# EAGLE schematic Schaltplan (EAGLE 9.7.0)

## Sheet 1 of 6: SCD30
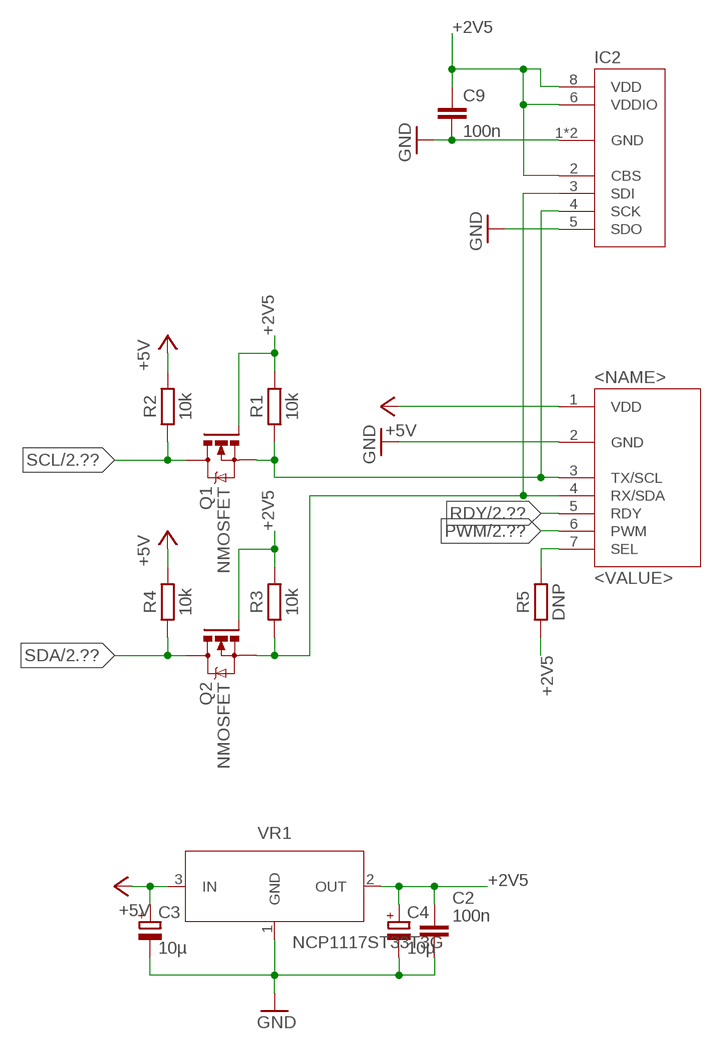
[diagram p0: schematic, sheet 1]

### Parts
C2  100n  C_CHIP-0603(1608-METRIC)  [CAPC1608X85]
C3  10µ  CPOL-EU153CLV-0505  [153CLV-0505]
C4  10µ  CPOL-EU153CLV-0505  [153CLV-0505]
C9  100n  C-EUC0603  [C0603]
IC2  BMP280  [SON65P200X250X95-8N]
Q1  NMOSFET  NMOSFETSOT23  [SOT23]
Q2  NMOSFET  NMOSFETSOT23  [SOT23]
R1  10k  R_CHIP-0603(1608-METRIC)  [RESC1608X60]
R2  10k  R_CHIP-0603(1608-METRIC)  [RESC1608X60]
R3  10k  R_CHIP-0603(1608-METRIC)  [RESC1608X60]
R4  10k  R_CHIP-0603(1608-METRIC)  [RESC1608X60]
R5  DNP  R_CHIP-0603(1608-METRIC)  [RESC1608X60]
U$1  SDC30  [HDRV7W80P254_1X7_1778X254X838B]
VR1  NCP1117ST33T3G  NCP1117ST33T3GSOT-223  [SOT230P700X170-4]

### Nets
+2V5: C2.1 C4.+ C9.1 IC2.2(CBS) IC2.6(VDDIO) IC2.8(VDD) Q1.1(G) Q2.1(G) R1.2 R3.2 R5.1 VR1.2(OUT)
+5V [high_power]: C3.+ R2.2 R4.2 U$1.1(VDD) VR1.3(IN) ; also sheet 2,3,4,5,6
GND: C2.2 C3.- C4.- C9.2 IC2.1(GND) IC2.5(SDO) IC2.7(GND) U$1.2(GND) VR1.1(GND) ; also sheet 2,3,4,5,6
N$1: IC2.4(SCK) Q1.2(S) R1.1 U$1.3(TX/SCL)
N$3: R5.2 U$1.7(SEL)
N$6: IC2.3(SDI) Q2.2(S) R3.1 U$1.4(RX/SDA)
PWM: U$1.6(PWM) ; also sheet 2,6
RDY: U$1.5(RDY) ; also sheet 2,6
SCL: Q1.3(D) R2.1 ; also sheet 2,6
SDA: Q2.3(D) R4.1 ; also sheet 2,6

## Sheet 2 of 6
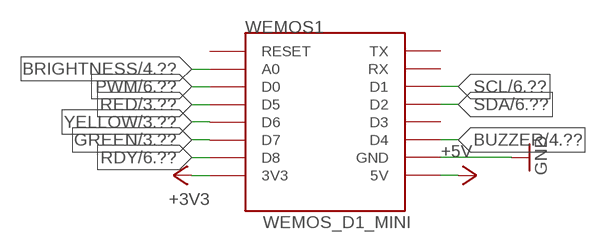
[diagram p1: schematic, sheet 2]

### Parts
WEMOS1  WEMOS_D1_MINI  [HDRVR8W64P254_1X8_2032X254X850B]

### Nets
+3V3: WEMOS1.3V3
+5V [high_power]: WEMOS1.5V ; also sheet 1,3,4,5,6
BRIGHTNESS: WEMOS1.A0 ; also sheet 4,6
BUZZER: WEMOS1.D4 ; also sheet 4,6
GND: WEMOS1.GND ; also sheet 1,3,4,5,6
GREEN: WEMOS1.D7 ; also sheet 3,6
PWM: WEMOS1.D0 ; also sheet 1,6
RDY: WEMOS1.D8 ; also sheet 1,6
RED: WEMOS1.D5 ; also sheet 3,6
SCL: WEMOS1.D1 ; also sheet 1,6
SDA: WEMOS1.D2 ; also sheet 1,6
YELLOW: WEMOS1.D6 ; also sheet 3,6
Unconnected: WEMOS1.D3 WEMOS1.RESET WEMOS1.RX WEMOS1.TX

## Sheet 3 of 6
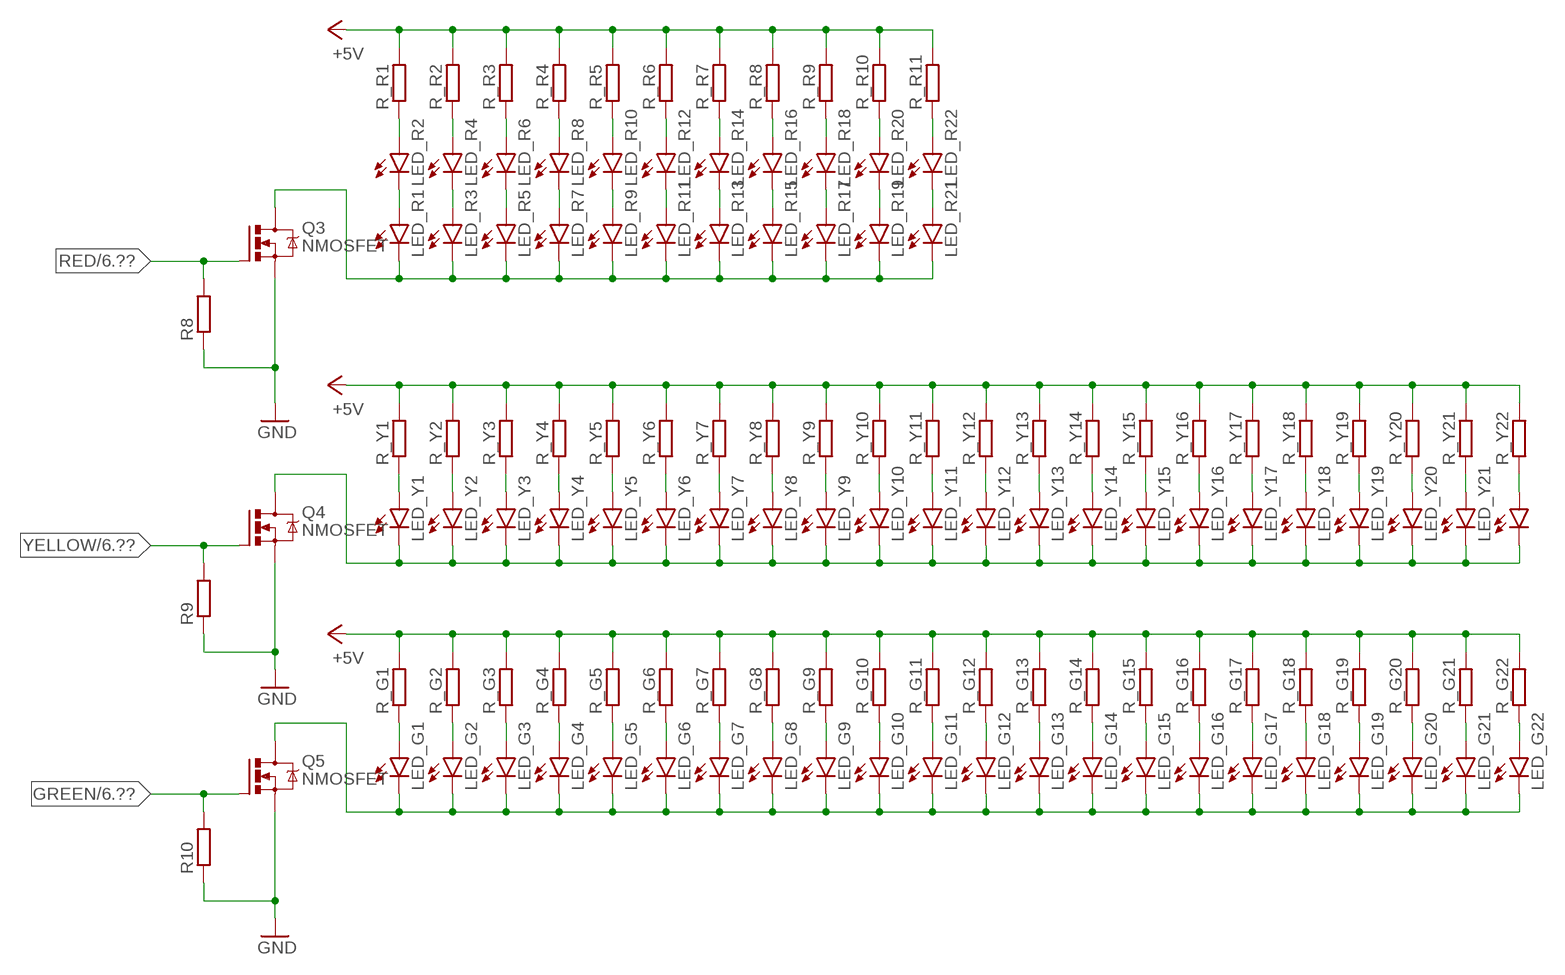
[diagram p2: schematic, sheet 3]

### Parts
LED_G1  LEDCHIP-LED0805  [CHIP-LED0805]
LED_G2  LEDCHIP-LED0805  [CHIP-LED0805]
LED_G3  LEDCHIP-LED0805  [CHIP-LED0805]
LED_G4  LEDCHIP-LED0805  [CHIP-LED0805]
LED_G5  LEDCHIP-LED0805  [CHIP-LED0805]
LED_G6  LEDCHIP-LED0805  [CHIP-LED0805]
LED_G7  LEDCHIP-LED0805  [CHIP-LED0805]
LED_G8  LEDCHIP-LED0805  [CHIP-LED0805]
LED_G9  LEDCHIP-LED0805  [CHIP-LED0805]
LED_G10  LEDCHIP-LED0805  [CHIP-LED0805]
LED_G11  LEDCHIP-LED0805  [CHIP-LED0805]
LED_G12  LEDCHIP-LED0805  [CHIP-LED0805]
LED_G13  LEDCHIP-LED0805  [CHIP-LED0805]
LED_G14  LEDCHIP-LED0805  [CHIP-LED0805]
LED_G15  LEDCHIP-LED0805  [CHIP-LED0805]
LED_G16  LEDCHIP-LED0805  [CHIP-LED0805]
LED_G17  LEDCHIP-LED0805  [CHIP-LED0805]
LED_G18  LEDCHIP-LED0805  [CHIP-LED0805]
LED_G19  LEDCHIP-LED0805  [CHIP-LED0805]
LED_G20  LEDCHIP-LED0805  [CHIP-LED0805]
LED_G21  LEDCHIP-LED0805  [CHIP-LED0805]
LED_G22  LEDCHIP-LED0805  [CHIP-LED0805]
LED_R1  LEDCHIP-LED0805  [CHIP-LED0805]
LED_R2  LEDCHIP-LED0805  [CHIP-LED0805]
LED_R3  LEDCHIP-LED0805  [CHIP-LED0805]
LED_R4  LEDCHIP-LED0805  [CHIP-LED0805]
LED_R5  LEDCHIP-LED0805  [CHIP-LED0805]
LED_R6  LEDCHIP-LED0805  [CHIP-LED0805]
LED_R7  LEDCHIP-LED0805  [CHIP-LED0805]
LED_R8  LEDCHIP-LED0805  [CHIP-LED0805]
LED_R9  LEDCHIP-LED0805  [CHIP-LED0805]
LED_R10  LEDCHIP-LED0805  [CHIP-LED0805]
LED_R11  LEDCHIP-LED0805  [CHIP-LED0805]
LED_R12  LEDCHIP-LED0805  [CHIP-LED0805]
LED_R13  LEDCHIP-LED0805  [CHIP-LED0805]
LED_R14  LEDCHIP-LED0805  [CHIP-LED0805]
LED_R15  LEDCHIP-LED0805  [CHIP-LED0805]
LED_R16  LEDCHIP-LED0805  [CHIP-LED0805]
LED_R17  LEDCHIP-LED0805  [CHIP-LED0805]
LED_R18  LEDCHIP-LED0805  [CHIP-LED0805]
LED_R19  LEDCHIP-LED0805  [CHIP-LED0805]
LED_R20  LEDCHIP-LED0805  [CHIP-LED0805]
LED_R21  LEDCHIP-LED0805  [CHIP-LED0805]
LED_R22  LEDCHIP-LED0805  [CHIP-LED0805]
LED_Y1  LEDCHIP-LED0805  [CHIP-LED0805]
LED_Y2  LEDCHIP-LED0805  [CHIP-LED0805]
LED_Y3  LEDCHIP-LED0805  [CHIP-LED0805]
LED_Y4  LEDCHIP-LED0805  [CHIP-LED0805]
LED_Y5  LEDCHIP-LED0805  [CHIP-LED0805]
LED_Y6  LEDCHIP-LED0805  [CHIP-LED0805]
LED_Y7  LEDCHIP-LED0805  [CHIP-LED0805]
LED_Y8  LEDCHIP-LED0805  [CHIP-LED0805]
LED_Y9  LEDCHIP-LED0805  [CHIP-LED0805]
LED_Y10  LEDCHIP-LED0805  [CHIP-LED0805]
LED_Y11  LEDCHIP-LED0805  [CHIP-LED0805]
LED_Y12  LEDCHIP-LED0805  [CHIP-LED0805]
LED_Y13  LEDCHIP-LED0805  [CHIP-LED0805]
LED_Y14  LEDCHIP-LED0805  [CHIP-LED0805]
LED_Y15  LEDCHIP-LED0805  [CHIP-LED0805]
LED_Y16  LEDCHIP-LED0805  [CHIP-LED0805]
LED_Y17  LEDCHIP-LED0805  [CHIP-LED0805]
LED_Y18  LEDCHIP-LED0805  [CHIP-LED0805]
LED_Y19  LEDCHIP-LED0805  [CHIP-LED0805]
LED_Y20  LEDCHIP-LED0805  [CHIP-LED0805]
LED_Y21  LEDCHIP-LED0805  [CHIP-LED0805]
LED_Y22  LEDCHIP-LED0805  [CHIP-LED0805]
Q3  NMOSFET  NMOSFETSOT23  [SOT23]
Q4  NMOSFET  NMOSFETSOT23  [SOT23]
Q5  NMOSFET  NMOSFETSOT23  [SOT23]
R8  R-EU_R0805  [R0805]
R9  R-EU_R0805  [R0805]
R10  R-EU_R0805  [R0805]
R_G1  R-EU_R0805  [R0805]
R_G2  R-EU_R0805  [R0805]
R_G3  R-EU_R0805  [R0805]
R_G4  R-EU_R0805  [R0805]
R_G5  R-EU_R0805  [R0805]
R_G6  R-EU_R0805  [R0805]
R_G7  R-EU_R0805  [R0805]
R_G8  R-EU_R0805  [R0805]
R_G9  R-EU_R0805  [R0805]
R_G10  R-EU_R0805  [R0805]
R_G11  R-EU_R0805  [R0805]
R_G12  R-EU_R0805  [R0805]
R_G13  R-EU_R0805  [R0805]
R_G14  R-EU_R0805  [R0805]
R_G15  R-EU_R0805  [R0805]
R_G16  R-EU_R0805  [R0805]
R_G17  R-EU_R0805  [R0805]
R_G18  R-EU_R0805  [R0805]
R_G19  R-EU_R0805  [R0805]
R_G20  R-EU_R0805  [R0805]
R_G21  R-EU_R0805  [R0805]
R_G22  R-EU_R0805  [R0805]
R_R1  R-EU_R0805  [R0805]
R_R2  R-EU_R0805  [R0805]
R_R3  R-EU_R0805  [R0805]
R_R4  R-EU_R0805  [R0805]
R_R5  R-EU_R0805  [R0805]
R_R6  R-EU_R0805  [R0805]
R_R7  R-EU_R0805  [R0805]
R_R8  R-EU_R0805  [R0805]
R_R9  R-EU_R0805  [R0805]
R_R10  R-EU_R0805  [R0805]
R_R11  R-EU_R0805  [R0805]
R_Y1  R-EU_R0805  [R0805]
R_Y2  R-EU_R0805  [R0805]
R_Y3  R-EU_R0805  [R0805]
R_Y4  R-EU_R0805  [R0805]
R_Y5  R-EU_R0805  [R0805]
R_Y6  R-EU_R0805  [R0805]
R_Y7  R-EU_R0805  [R0805]
R_Y8  R-EU_R0805  [R0805]
R_Y9  R-EU_R0805  [R0805]
R_Y10  R-EU_R0805  [R0805]
R_Y11  R-EU_R0805  [R0805]
R_Y12  R-EU_R0805  [R0805]
R_Y13  R-EU_R0805  [R0805]
R_Y14  R-EU_R0805  [R0805]
R_Y15  R-EU_R0805  [R0805]
R_Y16  R-EU_R0805  [R0805]
R_Y17  R-EU_R0805  [R0805]
R_Y18  R-EU_R0805  [R0805]
R_Y19  R-EU_R0805  [R0805]
R_Y20  R-EU_R0805  [R0805]
R_Y21  R-EU_R0805  [R0805]
R_Y22  R-EU_R0805  [R0805]

### Nets
+5V [high_power]: R_G1.2 R_G2.2 R_G3.2 R_G4.2 R_G5.2 R_G6.2 R_G7.2 R_G8.2 R_G9.2 R_G10.2 R_G11.2 R_G12.2 R_G13.2 R_G14.2 R_G15.2 R_G16.2 R_G17.2 R_G18.2 R_G19.2 R_G20.2 R_G21.2 R_G22.2 R_R1.2 R_R2.2 R_R3.2 R_R4.2 R_R5.2 R_R6.2 R_R7.2 R_R8.2 R_R9.2 R_R10.2 R_R11.2 R_Y1.2 R_Y2.2 R_Y3.2 R_Y4.2 R_Y5.2 R_Y6.2 R_Y7.2 R_Y8.2 R_Y9.2 R_Y10.2 R_Y11.2 R_Y12.2 R_Y13.2 R_Y14.2 R_Y15.2 R_Y16.2 R_Y17.2 R_Y18.2 R_Y19.2 R_Y20.2 R_Y21.2 R_Y22.2 ; also sheet 1,2,4,5,6
GND: Q3.2(S) Q4.2(S) Q5.2(S) R8.1 R9.1 R10.1 ; also sheet 1,2,4,5,6
GREEN: Q5.1(G) R10.2 ; also sheet 2,6
N$2: LED_G1.A R_G1.1
N$5: LED_R3.A LED_R4.C
N$7: LED_R4.A R_R2.1
N$9: LED_R5.A LED_R6.C
N$10: LED_R1.C LED_R3.C LED_R5.C LED_R7.C LED_R9.C LED_R11.C LED_R13.C LED_R15.C LED_R17.C LED_R19.C LED_R21.C Q3.3(D)
N$11: LED_Y1.C LED_Y2.C LED_Y3.C LED_Y4.C LED_Y5.C LED_Y6.C LED_Y7.C LED_Y8.C LED_Y9.C LED_Y10.C LED_Y11.C LED_Y12.C LED_Y13.C LED_Y14.C LED_Y15.C LED_Y16.C LED_Y17.C LED_Y18.C LED_Y19.C LED_Y20.C LED_Y21.C LED_Y22.C Q4.3(D)
N$12: LED_G1.C LED_G2.C LED_G3.C LED_G4.C LED_G5.C LED_G6.C LED_G7.C LED_G8.C LED_G9.C LED_G10.C LED_G11.C LED_G12.C LED_G13.C LED_G14.C LED_G15.C LED_G16.C LED_G17.C LED_G18.C LED_G19.C LED_G20.C LED_G21.C LED_G22.C Q5.3(D)
N$13: LED_Y1.A R_Y1.1
N$14: LED_R1.A LED_R2.C
N$15: LED_R2.A R_R1.1
N$16: LED_R6.A R_R3.1
N$18: LED_R7.A LED_R8.C
N$19: LED_R8.A R_R4.1
N$21: LED_R9.A LED_R10.C
N$22: LED_R10.A R_R5.1
N$24: LED_R11.A LED_R12.C
N$25: LED_R12.A R_R6.1
N$27: LED_R13.A LED_R14.C
N$28: LED_R14.A R_R7.1
N$30: LED_R15.A LED_R16.C
N$31: LED_R16.A R_R8.1
N$33: LED_R17.A LED_R18.C
N$34: LED_R18.A R_R9.1
N$36: LED_R19.A LED_R20.C
N$37: LED_R20.A R_R10.1
N$39: LED_R21.A LED_R22.C
N$40: LED_R22.A R_R11.1
N$42: LED_Y2.A R_Y2.1
N$44: LED_Y3.A R_Y3.1
N$46: LED_Y4.A R_Y4.1
N$48: LED_Y5.A R_Y5.1
N$50: LED_Y6.A R_Y6.1
N$52: LED_Y7.A R_Y7.1
N$54: LED_Y8.A R_Y8.1
N$56: LED_Y9.A R_Y9.1
N$58: LED_Y10.A R_Y10.1
N$60: LED_Y11.A R_Y11.1
N$62: LED_Y12.A R_Y12.1
N$64: LED_Y13.A R_Y13.1
N$66: LED_Y14.A R_Y14.1
N$68: LED_Y15.A R_Y15.1
N$70: LED_Y16.A R_Y16.1
N$72: LED_Y17.A R_Y17.1
N$74: LED_Y18.A R_Y18.1
N$76: LED_Y19.A R_Y19.1
N$78: LED_Y20.A R_Y20.1
N$80: LED_Y21.A R_Y21.1
N$82: LED_Y22.A R_Y22.1
N$84: LED_G2.A R_G2.1
N$86: LED_G3.A R_G3.1
N$88: LED_G4.A R_G4.1
N$90: LED_G5.A R_G5.1
N$92: LED_G6.A R_G6.1
N$94: LED_G7.A R_G7.1
N$96: LED_G8.A R_G8.1
N$98: LED_G9.A R_G9.1
N$100: LED_G10.A R_G10.1
N$102: LED_G11.A R_G11.1
N$104: LED_G12.A R_G12.1
N$106: LED_G13.A R_G13.1
N$108: LED_G14.A R_G14.1
N$110: LED_G15.A R_G15.1
N$112: LED_G16.A R_G16.1
N$114: LED_G17.A R_G17.1
N$116: LED_G18.A R_G18.1
N$118: LED_G19.A R_G19.1
N$120: LED_G20.A R_G20.1
N$122: LED_G21.A R_G21.1
N$124: LED_G22.A R_G22.1
RED: Q3.1(G) R8.2 ; also sheet 2,6
YELLOW: Q4.1(G) R9.2 ; also sheet 2,6

## Sheet 4 of 6
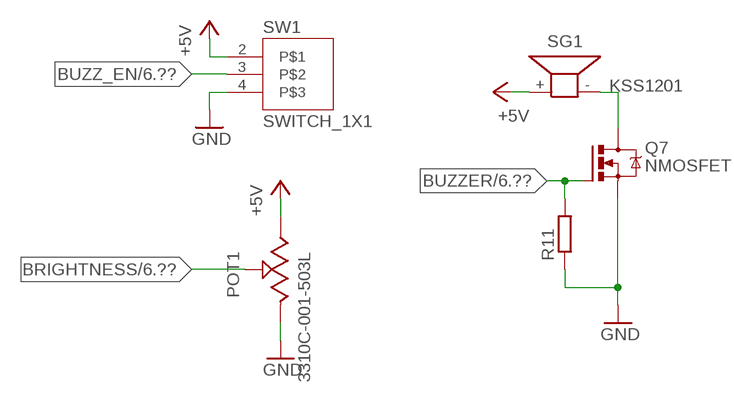
[diagram p3: schematic, sheet 4]

### Parts
POT1  3310C-001-503L  [3310C-001-503L]
Q7  NMOSFET  NMOSFETSOT23  [SOT23]
R11  R-EU_R0805  [R0805]
SG1  KSS1201  [KSS1201]
SW1  SWITCH_1X1  [HDRRAR5W64P200_1X5_1016X736X556B]

### Nets
+5V [high_power]: POT1.3 SG1.+ SW1.2 ; also sheet 1,2,3,5,6
BRIGHTNESS: POT1.2 ; also sheet 2,6
BUZZ_EN: SW1.3 ; also sheet 6
BUZZER: Q7.1(G) R11.2 ; also sheet 2,6
GND: POT1.1 Q7.2(S) R11.1 SW1.4 ; also sheet 1,2,3,5,6
N$32: Q7.3(D) SG1.-

## Sheet 5 of 6
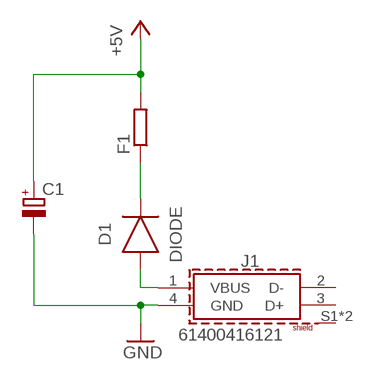
[diagram p4: schematic, sheet 5]

### Parts
C1  CPOL-EUF  [PANASONIC_F]
D1  DIODE  DIODEDO-214AC(SMA)  [DIOM5226X290N]
F1  R-EU_R1206  [R1206]
J1  61400416121  [61400416121]

### Nets
+5V [high_power]: C1.+ F1.2 ; also sheet 1,2,3,4,6
GND: C1.- J1.4(GND) ; also sheet 1,2,3,4,6
N$8: D1.1(C) F1.1
N$23: D1.2(A) J1.1(VBUS)
Unconnected: J1.2(D-) J1.3(D+) J1.S1(SHIELD) J1.S2(SHIELD)

## Sheet 6 of 6
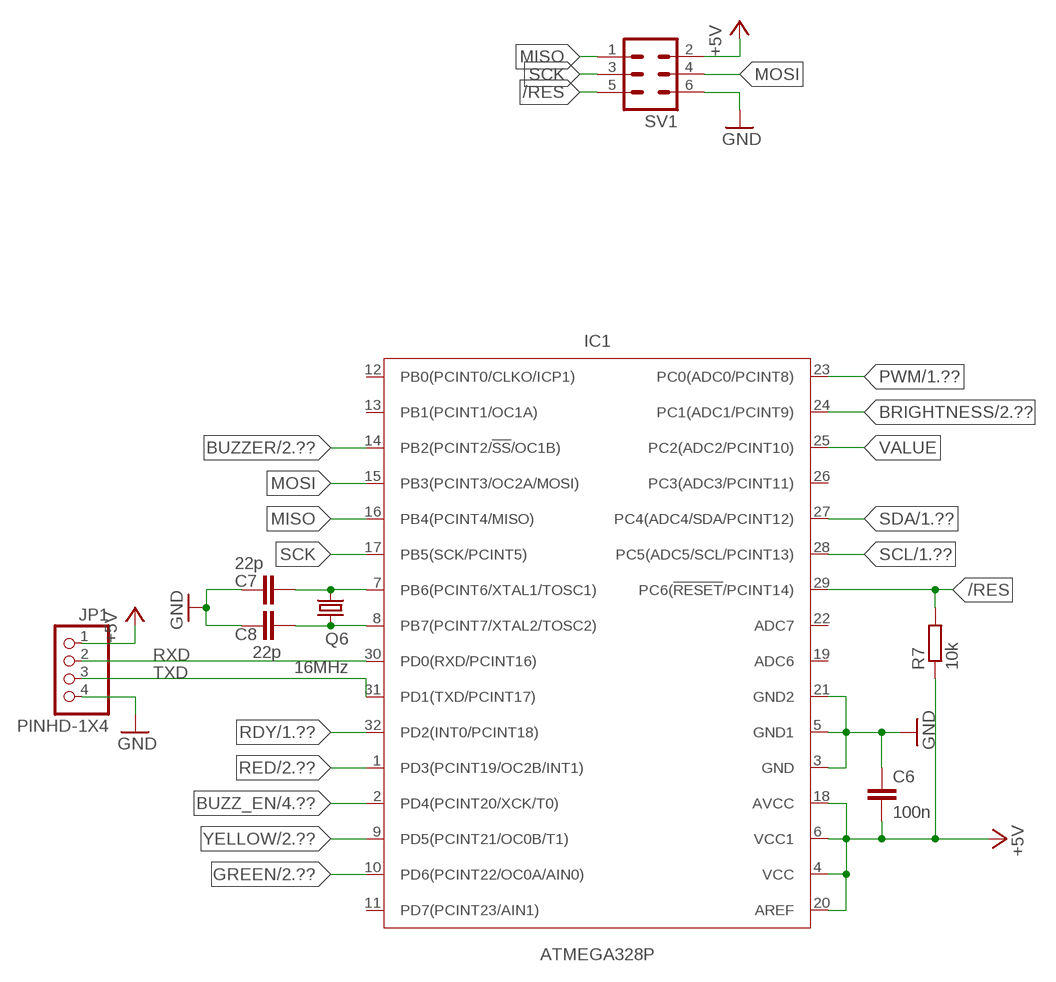
[diagram p5: schematic, sheet 6]

### Parts
C6  100n  C-EUC0603  [C0603]
C7  22p  C-EUC0603  [C0603]
C8  22p  C-EUC0603  [C0603]
IC1  ATMEGA328P  ATMEGA328-1_TQFP  [TQFP32-08]
JP1  PINHD-1X4  [1X04]
Q6  16MHz  CRYSTALHC49UP  [HC49UP]
R7  10k  R-EU_R0805  [R0805]
SV1  ML6  [ML6]

### Nets
+5V [high_power]: C6.2 IC1.4(VCC) IC1.6(VCC1) IC1.18(AVCC) IC1.20(AREF) JP1.1 R7.1 SV1.2 ; also sheet 1,2,3,4,5
/RES: IC1.29(PC6(!RESET!/PCINT14)) R7.2 SV1.5
BRIGHTNESS: IC1.24(PC1(ADC1/PCINT9)) ; also sheet 2,4
BUZZ_EN: IC1.2(PD4(PCINT20/XCK/T0)) ; also sheet 4
BUZZER: IC1.14(PB2(PCINT2/!SS!/OC1B)) ; also sheet 2,4
GND: C6.1 C7.1 C8.1 IC1.3(GND) IC1.5(GND1) IC1.21(GND2) JP1.4 SV1.6 ; also sheet 1,2,3,4,5
GREEN: IC1.10(PD6(PCINT22/OC0A/AIN0)) ; also sheet 2,3
MISO: IC1.16(PB4(PCINT4/MISO)) SV1.1
MOSI: IC1.15(PB3(PCINT3/OC2A/MOSI)) SV1.4
N$17: C7.2 IC1.7(PB6(PCINT6/XTAL1/TOSC1)) Q6.2
N$20: C8.2 IC1.8(PB7(PCINT7/XTAL2/TOSC2)) Q6.1
PWM: IC1.23(PC0(ADC0/PCINT8)) ; also sheet 1,2
RDY: IC1.32(PD2(INT0/PCINT18)) ; also sheet 1,2
RED: IC1.1(PD3(PCINT19/OC2B/INT1)) ; also sheet 2,3
RXD: IC1.30(PD0(RXD/PCINT16)) JP1.2
SCK: IC1.17(PB5(SCK/PCINT5)) SV1.3
SCL: IC1.28(PC5(ADC5/SCL/PCINT13)) ; also sheet 1,2
SDA: IC1.27(PC4(ADC4/SDA/PCINT12)) ; also sheet 1,2
TXD: IC1.31(PD1(TXD/PCINT17)) JP1.3
VALUE: IC1.25(PC2(ADC2/PCINT10))
YELLOW: IC1.9(PD5(PCINT21/OC0B/T1)) ; also sheet 2,3
Unconnected: IC1.11(PD7(PCINT23/AIN1)) IC1.12(PB0(PCINT0/CLKO/ICP1)) IC1.13(PB1(PCINT1/OC1A)) IC1.19(ADC6) IC1.22(ADC7) IC1.26(PC3(ADC3/PCINT11))

## Library data of the parts
C1 C3 C4 = rcl:CPOL-EU: POLARIZED CAPACITOR, European symbol; SPICEPREFIX: C
C2 = Capacitor:C: Capacitor - Generic; CATEGORY: Capacitor
C6-C9 = rcl:C-EU: CAPACITOR, European symbol; SPICEPREFIX: C
D1 = Diode:DIODE: Diode Rectifier - Generic; CATEGORY: Diode; SUB-CATEGORY: Rectifier
F1 R7-R11 R_G1-R_G22 R_R1-R_R11 R_Y1-R_Y22 = rcl:R-EU_: RESISTOR, European symbol; SPICEPREFIX: R
IC1 = IC_Embedded:ATMEGA328-1: 8-bit AVR Microcontroller with 32K Bytes In-System Programmable Flash Datasheet <https://www.mouser.com/pdfdocs/Gravitech_ATMEGA328_datasheet.pdf>; CATEGORY: IC_Embedded; MANUFACTURER: Microchip Technologies; MPN: ATmega328P-AU; OPERATING_TEMP: –40 to +105°C; PART_STATUS: Active; SUB-CATEGORY: Microcontroller
IC2 = SCD30:BMP280
J1 = Wurth_Connectors_WR-USB:61400416121: WR-COM USB 2.0 Horizontal THT Kind Properties Durability:1500 Mating cycles Quality Class:1 500 Mating cycles Connector Type:USB Gender:Female Type:Horizontal General Information Operating Temperature:-40up to +105 °C Compliance:RoHS Electrical Properties IR 1:1.5 A Working Voltage:30V (AC) Withstanding Voltage:750V (AC) Contact Resistance:20 mΩ Material Properties Insulator Material:PBT Insulator Flammability Rating:UL94 V-0 Color:White Cover Material:Brass Cover Plating:Nickel Contact Material:Copper Alloy Contact Plating:Selective Gold Contact Type:Stamped Shielding Material:Brass Shielding Plating:Nickel <https://www.we-online.com/catalog/media/o32985v209%20Family_WR-COM_61400416121.jpg> Details see: https://www.we-online.com/catalog/en/COM_TYPE_B_HORIZONTAL/ Updated by Yingchun, Shan 2020-01-16 2020 (C) Würth Elektronik; APPLICATION: USB 2.0; DATASHEET-URL: https://www.we-online.com/catalog/datasheet/61400416121.pdf; GERDER: Female; INTERFACE-TYPE: Type B; IR1: 1.5A; MOUNT: THT; PACKAGING: Tray; PART-NUMBER: 61400416121; PINS: 4; TYPE: Horizontal; WORKING-VOLTAGE: 30V(AC)
JP1 = Connector:PINHD-1X4: PIN HEADER; CATEGORY: CONNECTOR; SUB-CATEGORY: PIN-HEADER
LED_G1-LED_G22 LED_R1-LED_R22 LED_Y1-LED_Y22 = led:LED: LED OSRAM: - CHIPLED LG R971, LG N971, LY N971, LG Q971, LY Q971, LO R971, LY R971 LH N974, LH R974 LS Q976, LO Q976, LY Q976 LO Q996 - Hyper CHIPLED LW Q18S LB Q993, LB Q99A, LB R99A - SideLED LS A670, LO A670, LY A670, LG A670, LP A670 LB A673, LV A673, LT A673, LW A673 LH A674 LY A675 LS A676, LA A676, LO A676, LY A676, LW A676 LS A679, LY A679, LG A679 - Hyper Micro SIDELED® LS Y876, LA Y876, LO Y876, LY Y876 LT Y87S - SmartLED LW L88C, LW L88S LB L89C, LB L89S, LG L890 LS L89K, LO L89K, LY L89K LS L896, LA L896, LO L896, LY L896 - TOPLED LS T670, LO T670, LY T670, LG T670, LP T670 LSG T670, LSP T670, LSY T670, LOP T670, LYG T670 LG T671, LOG T671, LSG T671 LB T673, LV T673, LT T673, LW T673 LH T674 LS T676, LA T676, LO T676, LY T676, LB T676, LH T676, LSB T676, LW T676 LB T67C, LV T67C, LT T67C, LS T67K, LO T67K, LY T67K, LW E67C LS E67B, LA E67B, LO E67B, LY E67B, LB E67C, LV E67C, LT E67C LW T67C LS T679, LY T679, LG T679 LS T770, LO T770, LY T770, LG T770, LP T770 LB T773, LV T773, LT T773, LW T773 LH T774 LS E675, LA E675, LY E675, LS T675 LS T776, LA T776, LO T776, LY T776, LB T776 LHGB T686 LT T68C, LB T68C - Hyper Mini TOPLED® LB M676 - Mini TOPLED Santana® LG M470 LS M47K, LO M47K, LY M47K Source: http://www.osram.convergy.de LUXEON: - LUMILED® LXK2-PW12-R00, LXK2-PW12-S00, LXK2-PW14-U00, LXK2-PW14-V00 LXK2-PM12-R00, LXK2-PM12-S00, LXK2-PM14-U00 LXK2-PE12-Q00, LXK2-PE12-R00, LXK2-PE12-S00, LXK2-PE14-T00, LXK2-PE14-U00 LXK2-PB12-K00, LXK2-PB12-L00, LXK2-PB12-M00, LXK2-PB14-N00, LXK2-PB14-P00, LXK2-PB14-Q00 LXK2-PR12-L00, LXK2-PR12-M00, LXK2-PR14-Q00, LXK2-PR14-R00 LXK2-PD12-Q00, LXK2-PD12-R00, LXK2-PD12-S00 LXK2-PH12-R00, LXK2-PH12-S00 LXK2-PL12-P00, LXK2-PL12-Q00, LXK2-PL12-R00 Source: www.luxeon.com KINGBRIGHT: KA-3528ASYC Source: www.kingbright.com
POT1 = Potentiometer_Trimmers:3310C-001-503L: POT 50K OHM 1/4W PLASTIC LINEAR Manufacturer's datasheet <https://www.bourns.com/docs/Product-Datasheets/3310.pdf>; CREATED_BY: PCBLayout.com; DIGIKEY_PARTNO: 3310C-001-503L-ND; MANUFACTURER: Bourns Inc.; MPN: 3310C-001-503L
Q1-Q5 Q7 = Transistor:NMOSFET: N-Channel MOSFET - Generic; CATEGORY: Transistor; SUB-CATEGORY: MOSFET; TYPE: N-Channel
Q6 = crystal:CRYSTAL: CRYSTAL; OC_FARNELL: unknown; OC_NEWARK: unknown
R1-R5 = Resistor:R: Resistor Fixed - Generic; CATEGORY: Resistor; SUB-CATEGORY: Fixed
SG1 = buzzer:KSS1201: SPEAKER Source: Schukat; OC_FARNELL: unknown; OC_NEWARK: unknown
SV1 = con-harting-ml:ML6: HARTING; OC_FARNELL: unknown; OC_NEWARK: unknown
SW1 = Switches:SWITCH_1X1
U$1 = SCD30:SDC30
VR1 = IC_Power-Management:NCP1117ST33T3G: 1.0 A Low-Dropout Positive Fixed and Adjustable Voltage Regulators Datasheet <https://www.onsemi.com/pub/Collateral/NCP1117-D.PDF>; CATEGORY: IC_Power-Management; MANUFACTURER: ON Semiconductor; MPN: NCP1117ST33T3G; OPERATING_TEMP: 0 to +125 °C; PART_STATUS: Active; ROHS_COMPLIANT: RoHS3 Compliant; SERIES: NCP1117, NCV1117; SUB-CATEGORY: Voltage Regulator; TYPE: Linear
WEMOS1 = Wemos D1 mini:WEMOS_D1_MINI

## Net classes
0 default: width 0.152 mm
1 low_power: width 0.305 mm
2 high_power: width 0.508 mm